# Altium schematic sheet Power.SchDoc: STM32F446  Development Board
size A4; DrawnBy: EEE Patrick; Organization: PERT; Revision: A; SheetNumber: 1; SheetTotal: 3; Version: 1; Sub Team: EEE; Module: BMS; Generation: NA
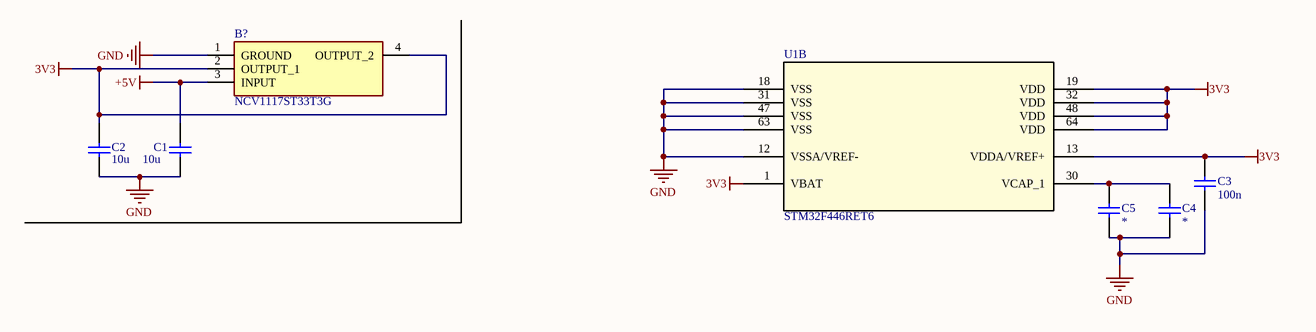
[diagram p0: Power.SchDoc]

## Parts
B?  NCV1117ST33T3G  [SOT230P700X180-4N]
C1  10u  [0603_SMD_C]
C2  10u  [0603_SMD_C]
C3  100n  [0603_SMD_RC]
C4  *  [0603_SMD_RC]
C5  *  [0603_SMD_RC]
U1  STM32F446RET6  [LQFP64-STM32F446]  (part B of 2)

## Nets
3V3: B?.2(OUTPUT_1) B?.4(OUTPUT_2) C2.2 C3.2 U1.1(VBAT) U1.13(VDDA/VREF+) U1.19(VDD) U1.32(VDD) U1.48(VDD) U1.64(VDD)
+5V: B?.3(INPUT) C1.2
GND: B?.1(GROUND) C1.1 C2.1 C3.1 C4.1 C5.1 U1.12(VSSA/VREF-) U1.18(VSS) U1.31(VSS) U1.47(VSS) U1.63(VSS)
NetC4_2: C4.2 C5.2 U1.30(VCAP_1)

## Notes on the sheet
- Title
- Generation
- Organization
- Sub Team
- Module
- Ver.
- Rev.
- Date
- Drawn By

## Library data of the parts
B? = NCV1117ST33T3G: ON SEMICONDUCTOR - NCV1117ST33T3G - Fixed LDO Voltage Regulator, 20V in, 1.07V Dropout, 3.3V/1A out, SOT-223-3; Manufacturer_Name: onsemi; Geometry.Height: 1.8mm; Mouser Part Number: 863-NCV1117ST33T3G; Mouser Price/Stock: https://www.mouser.co.uk/ProductDetail/onsemi/NCV1117ST33T3G?qs=8sOby8ZxZLHgqg5CFzeqiA%3D%3D; Manufacturer_Part_Number: NCV1117ST33T3G; Datasheet Link: http://www.onsemi.com/pub/Collateral/NCP1117-D.PDF
C1 C2 = 0603_SMD_Capacitor: 0603 SMD Capacitor; Value: 10u; Voltage Rating: *; Tolerance: *; Dielectric: *
C3-C5 = SMD 0603 Capacitor
  C3: Value: 100n
  C4 C5: Value: *
U1 = STM32F446RET6: No Description Available; Mfr_Name: STMicroelectronics; Copyright: Copyright (C) 2023 Ultra Librarian. All rights reserved.; Manufacturer_Part_Number: STM32F446RET6; RefDes: RefDes; Type: DEV